# EAGLE schematic schema (EAGLE 7.7.0)
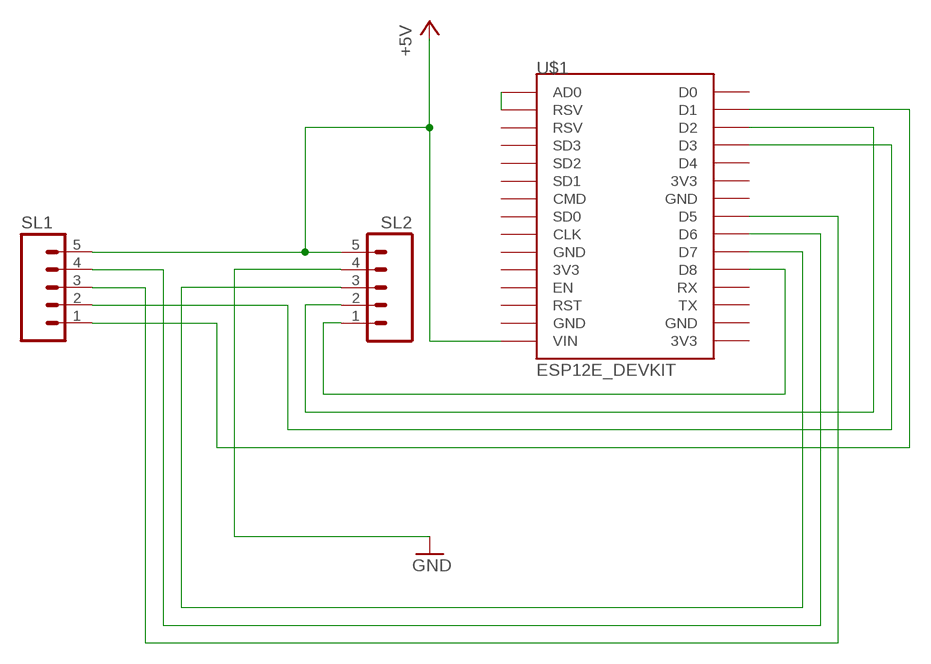
[diagram p0: schematic, sheet 1]

## Parts
SL1  M05  [05P]
SL2  M05  [05P]
U$1  ESP12E_DEVKIT  [ESP12E_DEVKIT]

## Nets
+5V: SL1.5 SL2.5 U$1.VIN
GND: SL2.4
N$1: U$1.AD0 U$1.RSV@0(RSV)
N$4: SL1.4 U$1.D6
N$5: SL2.3 U$1.D7
N$6: SL1.3 U$1.D5
N$7: SL2.2 U$1.D2
N$8: SL1.2 U$1.D3
N$9: SL2.1 U$1.D8
N$10: SL1.1 U$1.D1
Unconnected: U$1.3V3@0(3V3) U$1.3V3@1(3V3) U$1.3V3@2(3V3) U$1.CLK U$1.CMD U$1.D0 U$1.D4 U$1.EN U$1.GND@0(GND) U$1.GND@1(GND) U$1.GND@2(GND) U$1.GND@3(GND) U$1.RST U$1.RSV@1(RSV) U$1.RX U$1.SD0 U$1.SD1 U$1.SD2 U$1.SD3 U$1.TX

## Library data of the parts
SL1 SL2 = con-amp-quick:M05: AMP QUICK CONNECTOR; OC_FARNELL: unknown; OC_NEWARK: unknown
U$1 = nodemcu:ESP12E_DEVKIT: ESP12E DEVKIT BOARD